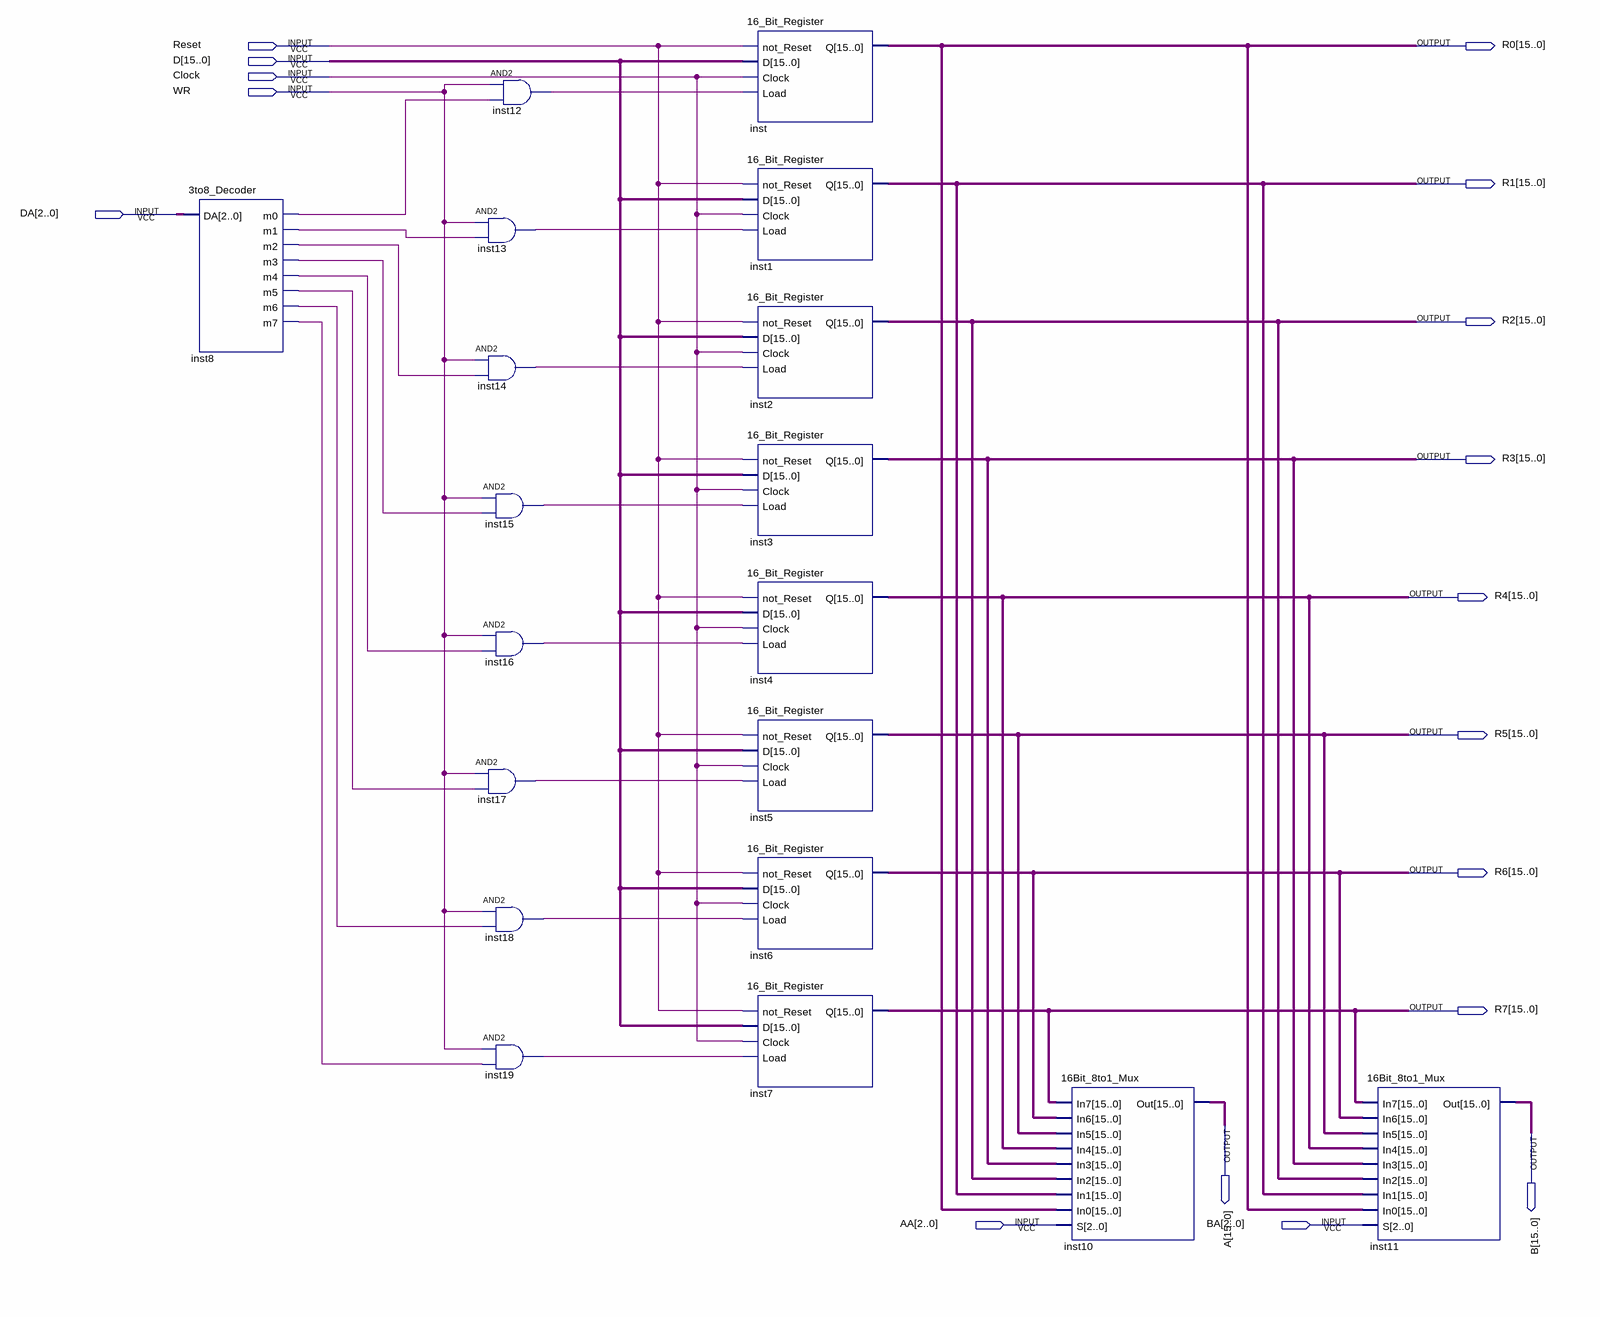
[diagram p0: schematic sheet]
// Quartus schematic Register_File_8x16.bdf as structural Verilog: 19 symbols, 17 pins
module Register_File_8x16 (
  input  Reset,
  input  [15:0] D,
  input  Clock,
  input  WR,
  input  [2:0] DA,
  input  [2:0] AA,
  input  [2:0] BA,
  output [15:0] R0,
  output [15:0] R1,
  output [15:0] R2,
  output [15:0] R3,
  output [15:0] R4,
  output [15:0] R5,
  output [15:0] R6,
  output [15:0] R7,
  output [15:0] A,
  output [15:0] B
);

  wire inst8_m0, inst8_m1, inst8_m2, inst8_m3, inst8_m4, inst8_m5, inst8_m6, inst8_m7, inst12_out,
       inst13_out, inst14_out, inst15_out, inst16_out, inst17_out, inst18_out, inst19_out;

  \3to8_Decoder  inst8 (
    .DA(DA), .m0(inst8_m0), .m1(inst8_m1), .m2(inst8_m2), .m3(inst8_m3), .m4(inst8_m4), .m5(inst8_m5),
    .m6(inst8_m6), .m7(inst8_m7));
  and inst13 (inst13_out, WR, inst8_m1);
  and inst14 (inst14_out, WR, inst8_m2);
  and inst15 (inst15_out, WR, inst8_m3);
  and inst16 (inst16_out, WR, inst8_m4);
  and inst17 (inst17_out, WR, inst8_m5);
  and inst18 (inst18_out, WR, inst8_m6);
  and inst19 (inst19_out, WR, inst8_m7);
  and inst12 (inst12_out, WR, inst8_m0);
  \16_Bit_Register  inst (.not_Reset(Reset), .D(D), .Clock(Clock), .Load(inst12_out), .Q(R0));
  \16_Bit_Register  inst1 (.not_Reset(Reset), .D(D), .Clock(Clock), .Load(inst13_out), .Q(R1));
  \16_Bit_Register  inst2 (.not_Reset(Reset), .D(D), .Clock(Clock), .Load(inst14_out), .Q(R2));
  \16_Bit_Register  inst3 (.not_Reset(Reset), .D(D), .Clock(Clock), .Load(inst15_out), .Q(R3));
  \16_Bit_Register  inst4 (.not_Reset(Reset), .D(D), .Clock(Clock), .Load(inst16_out), .Q(R4));
  \16_Bit_Register  inst5 (.not_Reset(Reset), .D(D), .Clock(Clock), .Load(inst17_out), .Q(R5));
  \16_Bit_Register  inst6 (.not_Reset(Reset), .D(D), .Clock(Clock), .Load(inst18_out), .Q(R6));
  \16_Bit_Register  inst7 (.not_Reset(Reset), .D(D), .Clock(Clock), .Load(inst19_out), .Q(R7));
  \16Bit_8to1_Mux  inst10 (
    .In7(R7), .In6(R6), .In5(R5), .In4(R4), .In3(R3), .In2(R2), .In1(R1), .In0(R0), .S(AA), .Out(A));
  \16Bit_8to1_Mux  inst11 (
    .In7(R7), .In6(R6), .In5(R5), .In4(R4), .In3(R3), .In2(R2), .In1(R1), .In0(R0), .S(BA), .Out(B));
endmodule
